# Altium schematic sheet HEADERS_2.SchDoc
size 420 x 297 mm; SheetNumber: 4; SheetTotal: 12
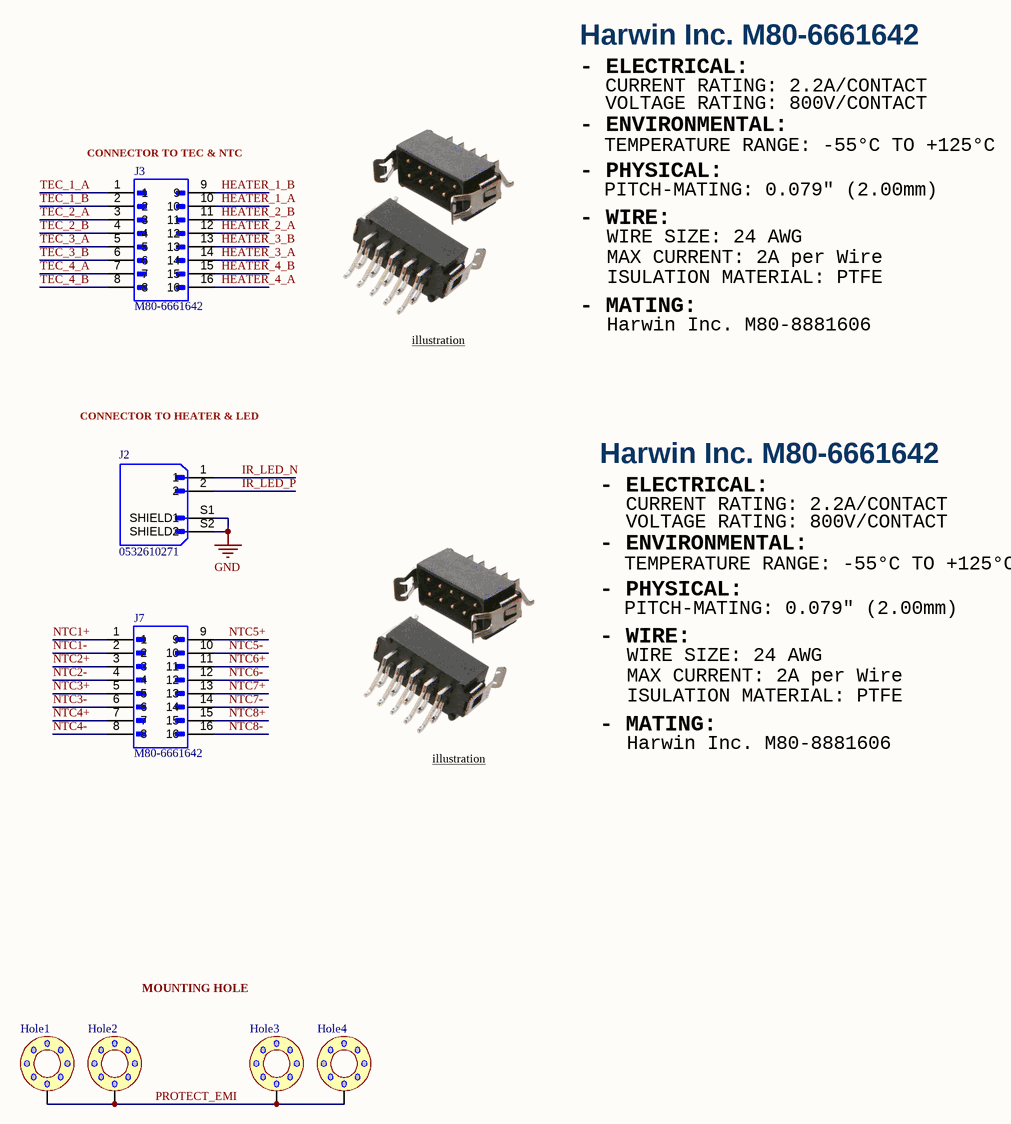
[diagram p0: HEADERS_2.SchDoc]

## Parts
Hole1  hole_space  [HOLE_SPACE]  (value not drawn)
Hole2  hole_space  [HOLE_SPACE]  (value not drawn)
Hole3  hole_space  [HOLE_SPACE]  (value not drawn)
Hole4  hole_space  [HOLE_SPACE]  (value not drawn)
J2  0532610271  [0532610271]
J3  M80-6661642  [M80-6661642]
J7  M80-6661642  [M80-6661642]

## Nets
GND: J2.S1(SHIELD1) J2.S2(SHIELD2)
HEATER_1_A: J3.10
HEATER_1_B: J3.9
HEATER_2_A: J3.12
HEATER_2_B: J3.11
HEATER_3_A: J3.14
HEATER_3_B: J3.13
HEATER_4_A: J3.16
HEATER_4_B: J3.15
IR_LED_N: J2.1
IR_LED_P: J2.2
NTC1+: J7.1
NTC1-: J7.2
NTC2+: J7.3
NTC2-: J7.4
NTC3+: J7.5
NTC3-: J7.6
NTC4+: J7.7
NTC4-: J7.8
NTC5+: J7.9
NTC5-: J7.10
NTC6+: J7.11
NTC6-: J7.12
NTC7+: J7.13
NTC7-: J7.14
NTC8+: J7.15
NTC8-: J7.16
PROTECT_EMI: Hole1.1 Hole2.1 Hole3.1 Hole4.1
TEC_1_A: J3.1
TEC_1_B: J3.2
TEC_2_A: J3.3
TEC_2_B: J3.4
TEC_3_A: J3.5
TEC_3_B: J3.6
TEC_4_A: J3.7
TEC_4_B: J3.8

## Notes on the sheet
- Harwin Inc. M80-6661642
- - ELECTRICAL:
- CURRENT RATING: 2.2A/CONTACT
- VOLTAGE RATING: 800V/CONTACT
- (near J3) CONNECTOR TO TEC & NTC
- - ENVIRONMENTAL:
- - PHYSICAL:
- TEMPERATURE RANGE: -55°C TO +125°C
- - WIRE:
- PITCH-MATING: 0.079" (2.00mm)
- WIRE SIZE: 24 AWG
- - MATING:
- MAX CURRENT: 2A per Wire
- ISULATION MATERIAL: PTFE
- illustration
- Harwin Inc. M80-8881606
- CONNECTOR TO HEATER & LED
- Labels drawn without touching a wire or pin: MOUNTING HOLE
- Project:
- PEE-PC1
- Sub-system:
- NANORACK_EXP_CONTROLLER
- Design by:
- SANG HUYNH
- BAO BUI Q.
- Sheet title:
- Sheet
- A3
- of
- Checked by:
- Approved by:
- VU PHAM
- Revision:
- Document No:
- V1.0.0
- Size:
- Date:

## Library data of the parts
J2 = CONN_SMD_02: CONN HEADER SMD R/A 2POS 1.25MM
J3 J7 = CONN_SMD_16: CONN HEADER SMD R/A 16POS 2MM